# EAGLE design nomad (EAGLE 7.3.0)
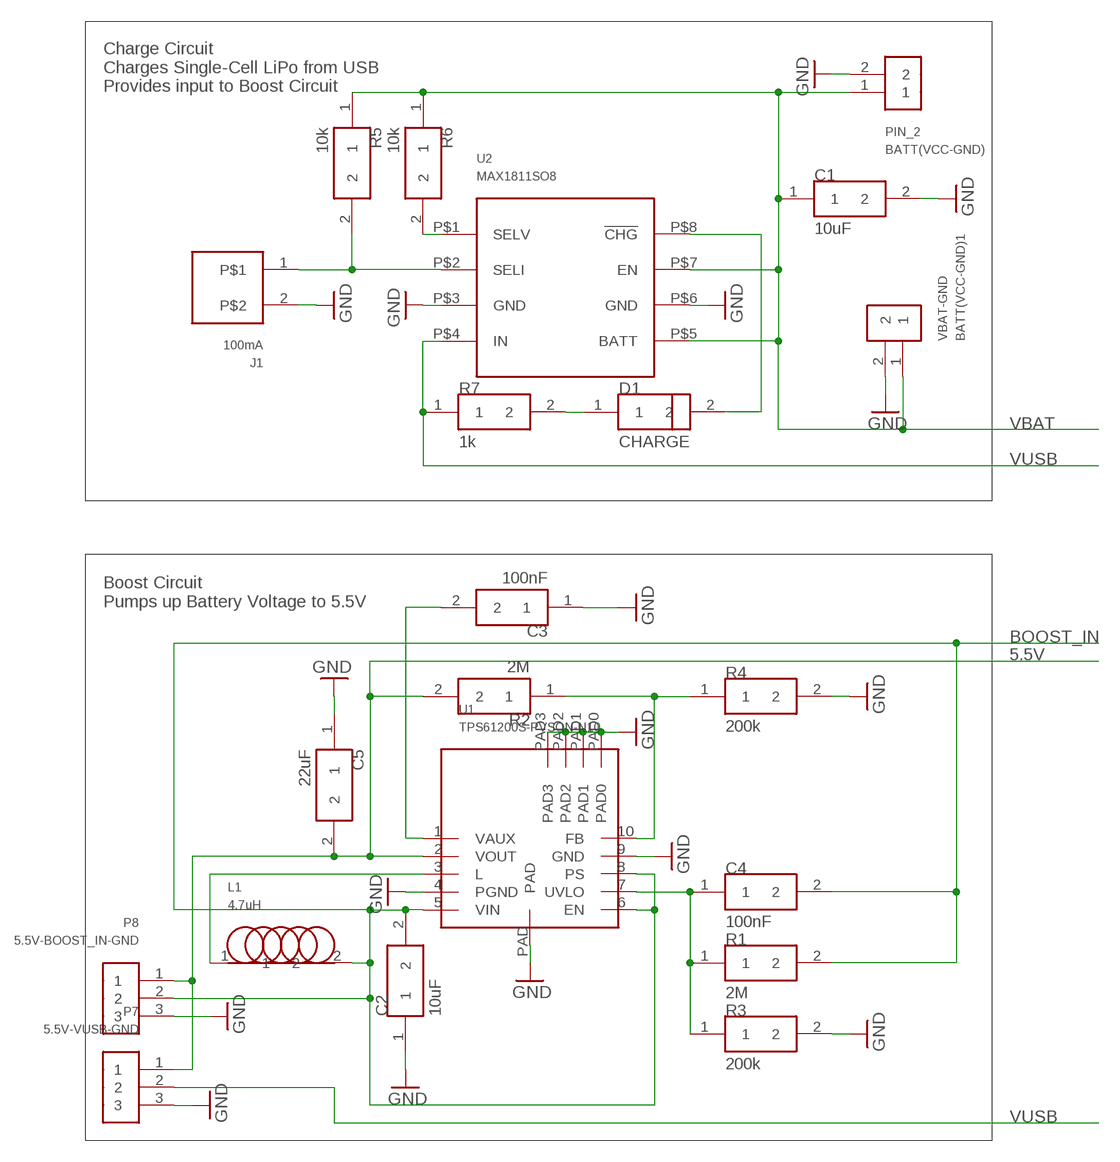
[diagram p0: schematic, sheet 1]

## Parts
BATT(VCC-GND)  PIN_2  [PIN_2]
BATT(VCC-GND)1  VBAT-GND  PIN_2  [PIN_2]
C1  10uF  CAP0805  [0805]
C2  10uF  CAP0805  [0805]
C3  100nF  CAP0805  [0805]
C4  100nF  CAP0805  [0805]
C5  22uF  CAP1206  [1206]
D1  CHARGE  LED0805  [0805]
J1  100mA  JMPSMD  [SMD_JMP]
L1  4.7uH  INDSMD-3232  [IND-SMD-3232]
P7  5.5V-VUSB-GND  PIN_3  [PIN_3]
P8  5.5V-BOOST_IN-GND  PIN_3  [PIN_3]
R1  2M  RES0805  [0805]
R2  2M  RES0805  [0805]
R3  200k  RES0805  [0805]
R4  200k  RES0805  [0805]
R5  10k  RES0805  [0805]
R6  10k  RES0805  [0805]
R7  1k  RES0805  [0805]
U1  TPS61200S-PVSON-N10  [S-PVSON-N10]
U2  MAX1811SO8  [SO8]

## Nets
5.5V: C5.2 P7.1 P8.1 R2.2 U1.2(VOUT)
BOOST_IN: C2.2 C4.2 L1.2 P8.2 R1.2 U1.5(VIN) U1.6(EN) U1.8(PS)
GND: BATT(VCC-GND)1.2 BATT(VCC-GND).2 C1.2 C2.1 C3.1 C5.1 J1.2 P7.3 P8.3 R3.2 R4.2 U1.4(PGND) U1.9(GND) U1.PAD U1.PAD0 U1.PAD1 U1.PAD2 U1.PAD3 U2.P$3(GND) U2.P$6(GND)
N$13: C4.1 R1.1 R3.1 U1.7(UVLO)
N$14: R2.1 R4.1 U1.10(FB)
N$15: C3.2 U1.1(VAUX)
N$16: L1.1 U1.3(L)
N$17: D1.2 U2.P$8(!CHG)
N$18: D1.1 R7.2
N$19: R6.2 U2.P$1(SELV)
N$20: J1.1 R5.2 U2.P$2(SELI)
VBAT: BATT(VCC-GND)1.1 BATT(VCC-GND).1 C1.1 R5.1 R6.1 U2.P$5(BATT) U2.P$7(EN)
VUSB: P7.2 R7.1 U2.P$4(IN)

## Notes on the sheet
- Charge Circuit
  Charges Single-Cell LiPo from USB
  Provides input to Boost Circuit
- Boost Circuit
  Pumps up Battery Voltage to 5.5V

## Library data of the parts
BATT(VCC-GND) BATT(VCC-GND)1 = dooba:PIN_2
C1-C5 = dooba:CAP
D1 = dooba:LED
J1 = dooba:JMP
L1 = dooba:IND
P7 P8 = dooba:PIN_3
R1-R7 = dooba:RES
U1 = dooba:TPS61200
U2 = dooba:MAX1811

## Board
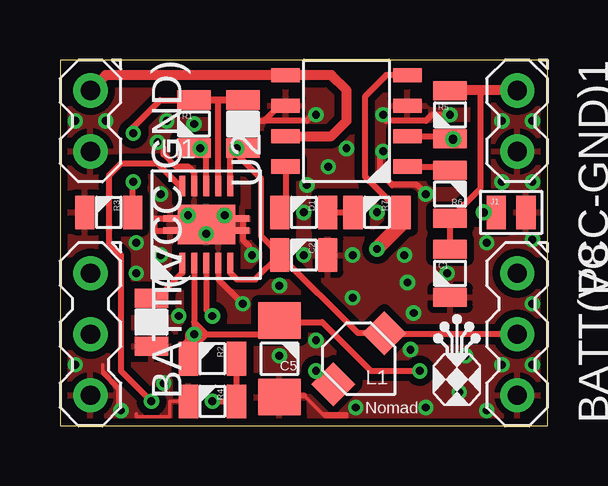
[diagram p1: board, top side]
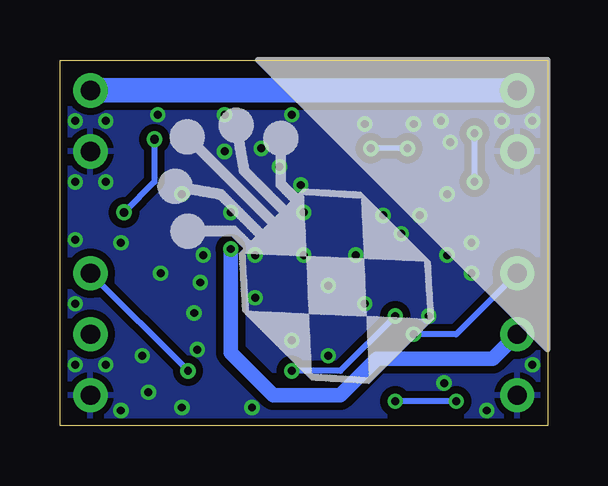
[diagram p2: board, bottom side, seen from below]

Size 20.32 x 15.24 mm. Coordinates in mm from the lower left corner, seen from the top.
Outline: 0,0 20.32,0 20.32,15.24 0,15.24 0,0
Copper layers (1*16): Top 0.035mm / dielectric 1.5mm / Bottom 0.035mm
Design rules "dooba": minimum track width 6mil, minimum drill 12mil, track to track 6mil, track to pad 6mil, pad to pad 6mil, via to via 6mil, smd to smd 0mil, copper to edge 10mil, drill to drill 10mil, minimum pad ring 10mil, minimum via ring 6mil, stop-mask expansion 2mil, vias tented up to drill 25mil, thermal gap 10mil

### Footprints (pad centres in the part's own frame; a part is rotated, then mirrored left to right if it is on the bottom)
PIN_2 = drill 0.8 pad 1.422: 1 -1.27,0; 2 1.27,0
0805 = smd 0.8 x 1.4: 1 -1,0; 2 1,0
1206 = smd 1.524 x 1.778: 1 -1.6,0; 2 1.6,0
SMD_JMP = smd 0.8 x 1.4: 1 -0.619,0; 2 0.619,0
IND-SMD-3232 = smd 1.3 x 1.3 rotated 315: 1 -1.061,1.061; 2 1.061,-1.061
PIN_3 = drill 0.8 pad 1.422: 1 -2.54,0; 2 0,0; 3 2.54,0
S-PVSON-N10 = smd 0.26 x 0.85: 1 -1,-1.6; 2 -0.5,-1.6; 3 0,-1.6; 4 0.5,-1.6; 5 1,-1.6; 6 1,1.6; 7 0.5,1.6; 8 0,1.6; 9 -0.5,1.6; 10 -1,1.6 | smd 2.4 x 1.65: PAD 0,0 | smd 0.6 x 0.28: PAD0 -1.499,0.25; PAD1 -1.499,-0.25; PAD2 1.499,0.25; PAD3 1.499,-0.25
SO8 = smd 0.6 x 1.2: P$1 -1.905,-2.54; P$2 -0.635,-2.54; P$3 0.635,-2.54; P$4 1.905,-2.54; P$5 1.905,2.54; P$6 0.635,2.54; P$7 -0.635,2.54; P$8 -1.905,2.54

### Placement (x,y rotation side)
BATT(VCC-GND)  1.27,12.7 270 top
BATT(VCC-GND)1  19.05,12.7 270 top
C1  16.26,6.35 270 top
C2  10.16,7.11 180 top
C3  3.81,4.32 90 top
C4  7.62,12.57 270 top
C5  9.14,2.79 90 top
D1  10.16,8.89 180 top
J1  18.8,8.89 0 top
L1  12.45,2.79 90 top
P7  1.27,3.81 270 top
P8  19.05,3.81 270 top
R1  5.59,12.57 270 top
R2  6.35,2.79 180 top
R3  2.03,8.89 180 top
R4  6.35,1.02 180 top
R5  16.26,12.95 270 top
R6  16.26,9.65 90 top
R7  13.21,8.89 180 top
U1  6.1,8.38 0 top
U2  11.94,12.7 90 top

### Tracks (layer width: path | path; a pad name or v marks a point on that pad's centre or on a via)
5.5V  (via drill 0.33)
  Top 0.254: R2.2 5.35,3.79 | 5.35,3.79 5.33,3.81 | 5.33,3.81 v5.59,3.81 | 6.1,3.81 8.56,3.81 C5.2 9.22,4.32 10.92,4.32 12.95,2.29 v14.99,2.29 | U1.2 5.6,4.07 5.59,4.06 | 5.35,3.83 5.33,3.81 | 5.35,3.79 5.35,3.83 | 5.35,3.83 5.59,4.06 | 5.59,4.06 5.84,4.06 | 6.1,3.81 5.84,3.81 | 5.84,3.81 5.59,3.56 | 5.59,3.56 5.35,3.79 | 5.33,3.81 5.33,3.56 | 5.33,3.56 5.59,3.56 | v5.59,3.81 5.59,3.56 | 5.59,3.56 5.84,3.3 | 5.84,3.56 5.84,3.3 | 5.59,3.3 5.84,3.3 | 5.84,3.3 5.59,3.05 5.33,3.05 5.08,3.3 5.33,3.56 | 5.59,3.56 5.84,3.56 | 5.84,3.56 6.1,3.81 | 6.1,3.81 5.84,4.06 | 5.84,4.06 5.59,4.32 | v5.59,3.81 5.84,3.81
  Bottom 0.254: P7.1 3.81,3.81 v5.59,3.81 | v14.99,2.29 P8.1
BOOST_IN  (via drill 0.33)
  Top 0.254: U1.6 7.1,11.54 7.11,11.56 v7.37,11.56 | v7.37,11.56 7.6,11.56 C4.2 | U1.8 6.1,11.56 v5.84,11.56 5.6,11.56 R1.2 | P8.2 13.55,3.81 L1.2 12.42,3.85 C2.2 | U1.5 7.1,6.37 7.37,6.1 8.14,6.1 C2.2 | C2.2 8.38,7.89 8.38,10.29 7.37,11.3 v7.37,11.56
  Bottom 0.254: v5.84,11.56 v7.37,11.56
GND  (via drill 0.33)
  Top 0.152: 10.16,1.27 10.92,0.51 | 10.92,0.51 11.05,0.38 11.94,0.38 11.94,0.51 10.92,0.51 | R4.2 4.57,1.02 4.57,0.38 3.17,0.38 3.17,0.51 | v2.54,0.63 2.41,0.76 2.41,1.52 | 2.41,1.52 2.41,1.65 1.78,2.29 | 1.78,2.29 1.78,2.54 | 1.78,2.29 1.78,2.16 2.41,1.52
  Top 0.254: U1.4 6.6,6.1 v7.62,5.08 | C5.1 9.22,1.27 10.16,1.27 | U1.9 5.6,10.53 5.33,10.79 4.83,10.79 4.32,11.3 4.32,11.56 | 6.6,8.13 3.94,8.13 3.94,8.64 3.94,8.63 U1.PAD0 7.62,8.63 7.62,8.64 7.62,7.75 7.87,7.49 | 6.6,8.13 U1.PAD3 | U1.PAD 6.35,8.38 6.6,8.13 | v15.24,9.65 14.86,10.03 13.84,10.03 13.34,10.54 13.34,11.3 v13.46,11.43 | v16.25,12.96 15.62,12.96 15.62,12.95 15.49,12.95 15.24,12.7 13.59,12.7 13.46,12.83 | v10.67,12.95 10.54,12.95 10.29,12.7 8.51,12.7 | 8,12.7 8.51,12.7 | 8.51,12.7 9.02,13.21 9.14,13.21 9.27,13.33
  Bottom 0.254: v7.62,5.08 7.62,4.83
  other vias: 13.46,12.95 19.69,12.7 18.41,12.7 18.41,10.16 19.69,10.16 19.69,5.08 19.69,2.54 18.41,2.54 0.63,12.7 1.9,12.7 0.63,2.54 17.78,0.63 10.67,3.56 5.59,12.57 4.19,9.65 3.17,6.35 3.17,7.62 8,7.11 11.18,10.79 10.16,7.11 12.19,7.11 14.35,7.11 12.19,5.33 14.73,4.7 14.48,5.97 16.13,6.35 13.21,8.89 10.16,8.89 9.14,5.84 17.78,7.62 19.69,7.75 14.6,3.17 12.32,0.76 16.89,2.92 15.24,0.76 16.64,1.4 4.32,1.78 4.95,4.57 4.19,7.11 4.06,11.81 4.45,12.7 7.62,12.57 9.14,2.92 11.94,11.56 10.29,10.03 5.33,8.76 6.86,8.76 6.1,8
  pour Top (isolate 0.305): 0,15.24 20.32,15.24 20.32,0 0,0
  pour Bottom (isolate 0.305): 0,15.24 20.32,15.24 20.32,0 0,0
N$13  (via drill 0.33)
  Top 0.254: 6.6,13.59 7.35,13.59 C4.1 R1.1 4.17,13.57 3.05,12.45 v3.05,12.19 | 6.6,13.59 6.1,13.59 | U1.7 6.6,13.58 6.6,13.59 | R3.1 3.03,10.14 v3.05,10.16
  Bottom 0.254: v3.05,10.16 v3.05,12.19
N$14  (via drill 0.33)
  Top 0.254: U1.10 5.1,9.89 4.06,10.92 2.54,10.92 2.03,10.41 2.03,7.62 2.54,7.11 2.54,2.29 v3.81,1.02 | v6.35,1.02 R4.1 R2.1
  Bottom 0.254: v3.81,1.02 v6.35,1.02
N$15
  Top 0.254: U1.1 5.1,6.37 4.32,5.59 4.08,5.59 C3.2
N$16  (via drill 0.33)
  Top 0.254: U1.3 6.1,4.83 v6.35,4.57 | v10.67,2.29 11.22,1.73 L1.1
  Bottom 0.254: v6.35,4.57 8.64,2.29 v10.67,2.29
N$17
  Top 0.254: U2.P$8 9.4,9.13 D1.2
N$18
  Top 0.254: D1.1 R7.2
N$19
  Top 0.254: U2.P$1 16.11,10.79 R6.2
N$20  (via drill 0.36)
  Top 0.254: U2.P$2 16.14,12.06 R5.2 16.37,11.95 v16.38,11.94 | v17.65,8.89 J1.1
  Bottom 0.254: v16.38,11.94 16.38,10.16 v17.65,8.89
VBAT
  Top 0.254: C1.1 R6.1 16.27,8.65 17.53,9.91 17.53,13.97
  Top 0.406: BATT(VCC-GND).1 1.9,14.6 U2.P$5 11.3,14.6 11.94,13.97 11.94,12.7 11.3,12.06 U2.P$7 | BATT(VCC-GND)1.1 17.53,13.97 16.27,13.97 R5.1
  Bottom 1.016: BATT(VCC-GND)1.1 BATT(VCC-GND).1
VUSB  (via drill 0.33)
  Top 0.254: U2.P$4 13.59,14.6 12.7,13.72 12.7,10.4 R7.1
  Top 0.61: v13.21,7.37 14.21,8.37 R7.1
  Bottom 0.61: P7.2 2.29,2.79 7.11,2.79 8.64,1.27 11.43,1.27 13.21,3.05 v13.21,7.37

### Text on the board
tPlace: Nomad
Refs: R1 | C4 | R5 | U2 | R3 | D1 | R7 | R6 | U1 | C2 | C1 | C3 | R2 | C5 | L1 | R4